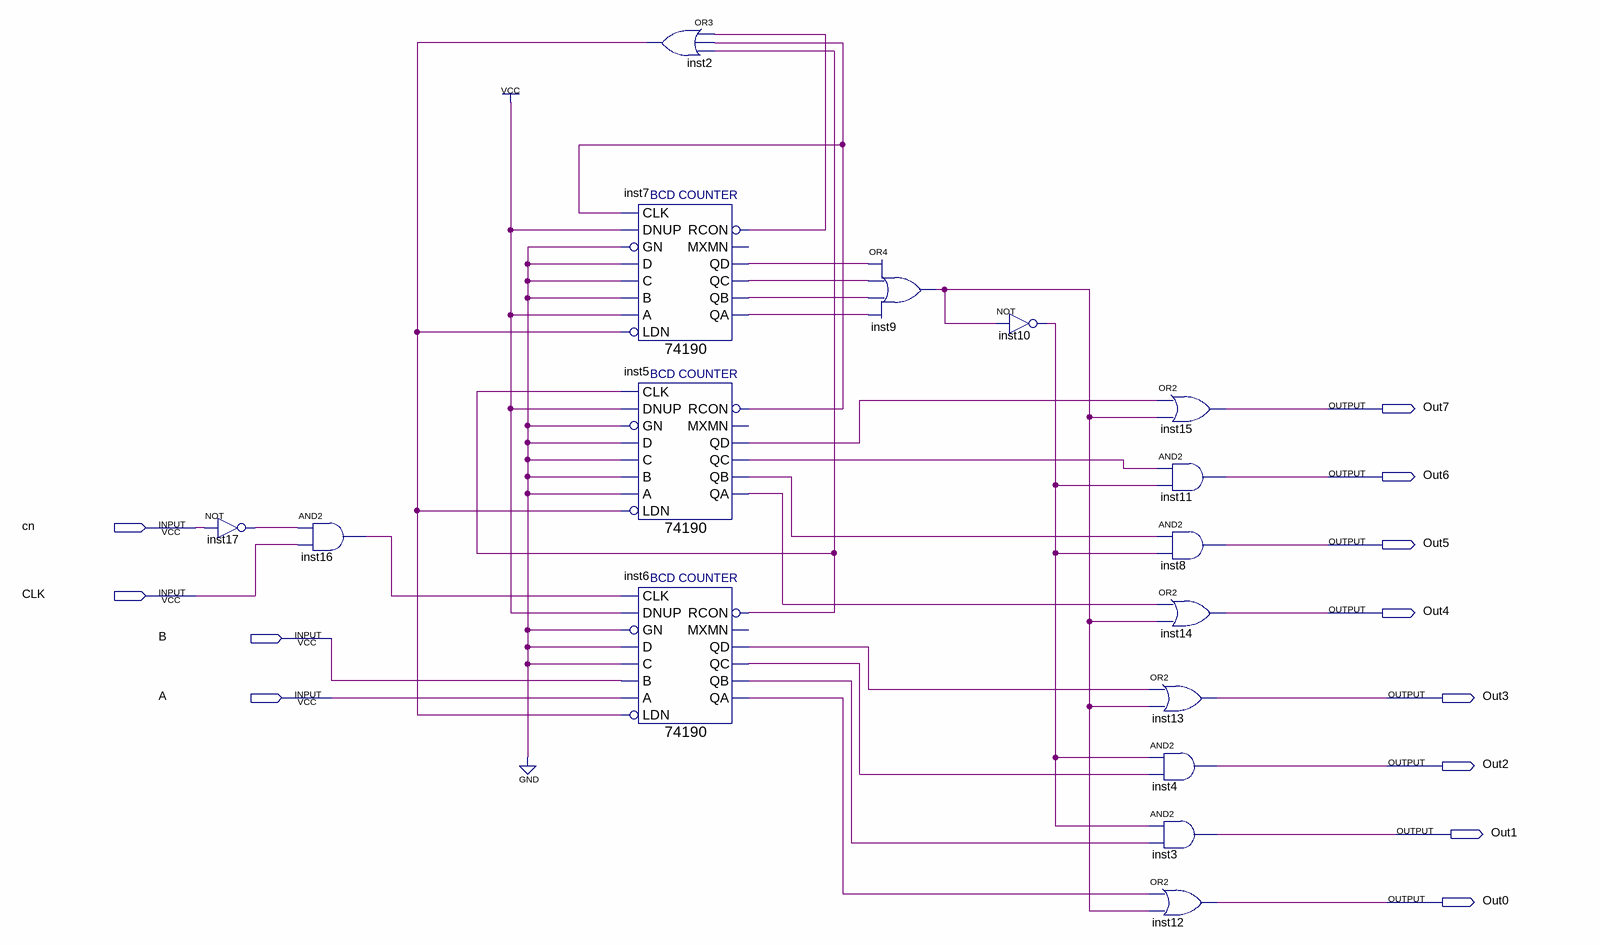
[diagram p0: schematic sheet]
// Quartus schematic more100.bdf as structural Verilog: 16 symbols, 12 pins
module more100 (
  input  cn,
  input  CLK,
  input  B,
  input  A,
  output Out7,
  output Out6,
  output Out5,
  output Out4,
  output Out3,
  output Out2,
  output Out1,
  output Out0
);

  wire inst2_out, inst5_qa, inst5_qb, inst5_qc, inst5_qd, inst5_rcon, inst6_qa, inst6_qb, inst6_qc, inst6_qd,
       inst6_rcon, inst7_qa, inst7_qb, inst7_qc, inst7_qd, inst7_rcon, inst9_out, inst10_out, inst16_out,
       inst17_out;

  not inst17 (inst17_out, cn);
  and inst16 (inst16_out, inst17_out, CLK);
  or inst2 (inst2_out, inst7_rcon, inst5_rcon, inst6_rcon);
  \74190  inst7 (
    .LDN(inst2_out), .A(1'b1), .C(1'b0), .B(1'b0), .D(1'b0), .GN(1'b0), .CLK(inst5_rcon), .DNUP(1'b1),
    .QA(inst7_qa), .QB(inst7_qb), .QD(inst7_qd), .QC(inst7_qc), .RCON(inst7_rcon));  // open: MXMN
  \74190  inst5 (
    .LDN(inst2_out), .A(1'b0), .C(1'b0), .B(1'b0), .D(1'b0), .GN(1'b0), .CLK(inst6_rcon), .DNUP(1'b1),
    .QA(inst5_qa), .QB(inst5_qb), .QD(inst5_qd), .QC(inst5_qc), .RCON(inst5_rcon));  // open: MXMN
  \74190  inst6 (
    .LDN(inst2_out), .A(A), .C(1'b0), .B(B), .D(1'b0), .GN(1'b0), .CLK(inst16_out), .DNUP(1'b1),
    .QA(inst6_qa), .QB(inst6_qb), .QD(inst6_qd), .QC(inst6_qc), .RCON(inst6_rcon));  // open: MXMN
  or inst9 (inst9_out, inst7_qd, inst7_qc, inst7_qb, inst7_qa);
  not inst10 (inst10_out, inst9_out);
  or inst15 (Out7, inst5_qd, inst9_out);
  and inst11 (Out6, inst5_qc, inst10_out);
  and inst8 (Out5, inst5_qb, inst10_out);
  or inst14 (Out4, inst5_qa, inst9_out);
  or inst13 (Out3, inst6_qd, inst9_out);
  and inst4 (Out2, inst10_out, inst6_qc);
  and inst3 (Out1, inst10_out, inst6_qb);
  or inst12 (Out0, inst6_qa, inst9_out);
endmodule
